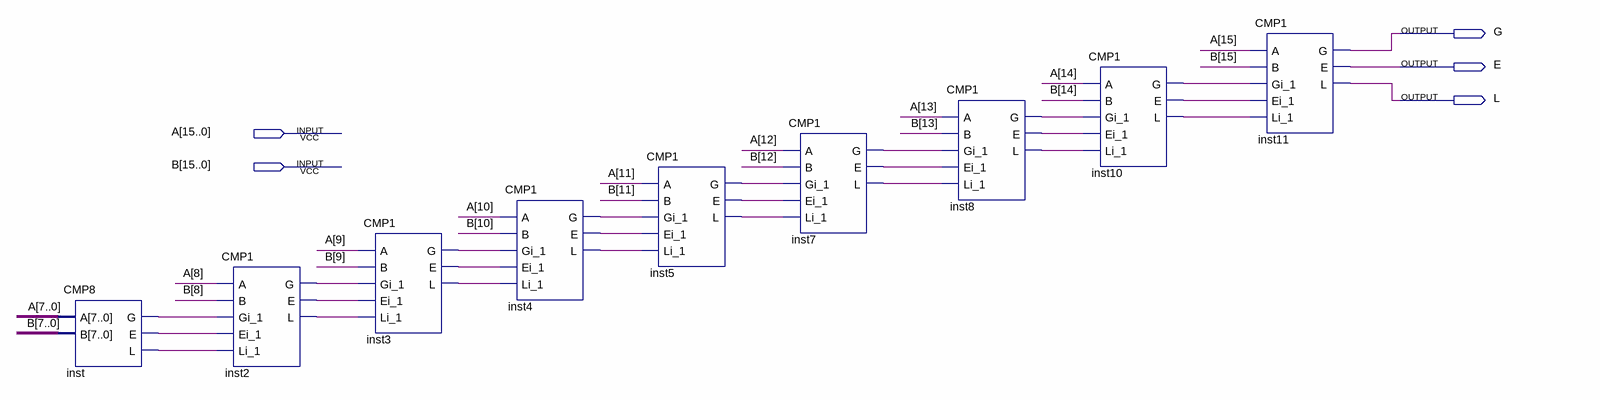
[diagram p0: schematic sheet]
// Quartus schematic CMP16.bdf as structural Verilog: 9 symbols, 5 pins
module CMP16 (
  input  [15:0] A,
  input  [15:0] B,
  output G,
  output E,
  output L
);

  wire inst2_e, inst2_g, inst2_l, inst3_e, inst3_g, inst3_l, inst4_e, inst4_g, inst4_l, inst5_e, inst5_g,
       inst5_l, inst7_e, inst7_g, inst7_l, inst8_e, inst8_g, inst8_l, inst10_e, inst10_g, inst10_l, inst_e,
       inst_g, inst_l;

  CMP8 inst (.A(A[7:0]), .B(B[7:0]), .G(inst_g), .E(inst_e), .L(inst_l));
  CMP1 inst2 (.A(A[8]), .B(B[8]), .Gi_1(inst_g), .Ei_1(inst_e), .Li_1(inst_l), .G(inst2_g), .E(inst2_e), .L(inst2_l));
  CMP1 inst3 (
    .A(A[9]), .B(B[9]), .Gi_1(inst2_g), .Ei_1(inst2_e), .Li_1(inst2_l), .G(inst3_g), .E(inst3_e), .L(inst3_l));
  CMP1 inst4 (
    .A(A[10]), .B(B[10]), .Gi_1(inst3_g), .Ei_1(inst3_e), .Li_1(inst3_l), .G(inst4_g), .E(inst4_e),
    .L(inst4_l));
  CMP1 inst5 (
    .A(A[11]), .B(B[11]), .Gi_1(inst4_g), .Ei_1(inst4_e), .Li_1(inst4_l), .G(inst5_g), .E(inst5_e),
    .L(inst5_l));
  CMP1 inst7 (
    .A(A[12]), .B(B[12]), .Gi_1(inst5_g), .Ei_1(inst5_e), .Li_1(inst5_l), .G(inst7_g), .E(inst7_e),
    .L(inst7_l));
  CMP1 inst8 (
    .A(A[13]), .B(B[13]), .Gi_1(inst7_g), .Ei_1(inst7_e), .Li_1(inst7_l), .G(inst8_g), .E(inst8_e),
    .L(inst8_l));
  CMP1 inst10 (
    .A(A[14]), .B(B[14]), .Gi_1(inst8_g), .Ei_1(inst8_e), .Li_1(inst8_l), .G(inst10_g), .E(inst10_e),
    .L(inst10_l));
  CMP1 inst11 (.A(A[15]), .B(B[15]), .Gi_1(inst10_g), .Ei_1(inst10_e), .Li_1(inst10_l), .G(G), .E(E), .L(L));
endmodule
